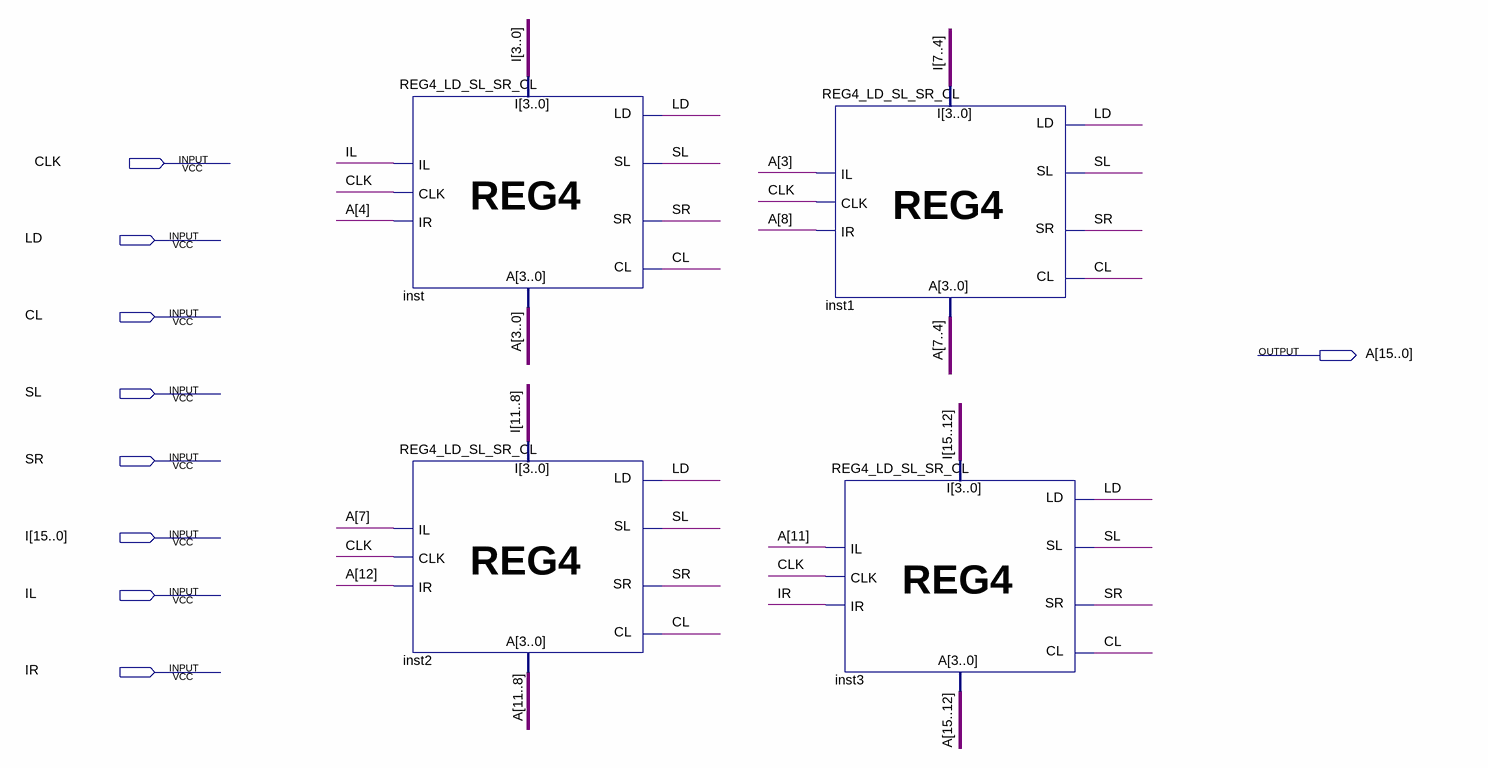
[diagram p0: schematic sheet]
// Quartus schematic REG16_LD_SL_SR_CL.bdf as structural Verilog: 4 symbols, 9 pins
module REG16_LD_SL_SR_CL (
  input  CLK,
  input  LD,
  input  CL,
  input  SL,
  input  SR,
  input  [15:0] I,
  input  IL,
  input  IR,
  output [15:0] A
);

  REG4_LD_SL_SR_CL inst (.CLK(CLK), .LD(LD), .SL(SL), .SR(SR), .I(I[3:0]), .IL(IL), .IR(A[4]), .CL(CL), .A(A[3:0]));
  REG4_LD_SL_SR_CL inst2 (
    .CLK(CLK), .LD(LD), .SL(SL), .SR(SR), .I(I[11:8]), .IL(A[7]), .IR(A[12]), .CL(CL), .A(A[11:8]));
  REG4_LD_SL_SR_CL inst1 (.CLK(CLK), .LD(LD), .SL(SL), .SR(SR), .I(I[7:4]), .IL(A[3]), .IR(A[8]), .CL(CL), .A(A[7:4]));
  REG4_LD_SL_SR_CL inst3 (
    .CLK(CLK), .LD(LD), .SL(SL), .SR(SR), .I(I[15:12]), .IL(A[11]), .IR(IR), .CL(CL), .A(A[15:12]));
endmodule
